# EAGLE design pcb_inverter (EAGLE 6.6.0)
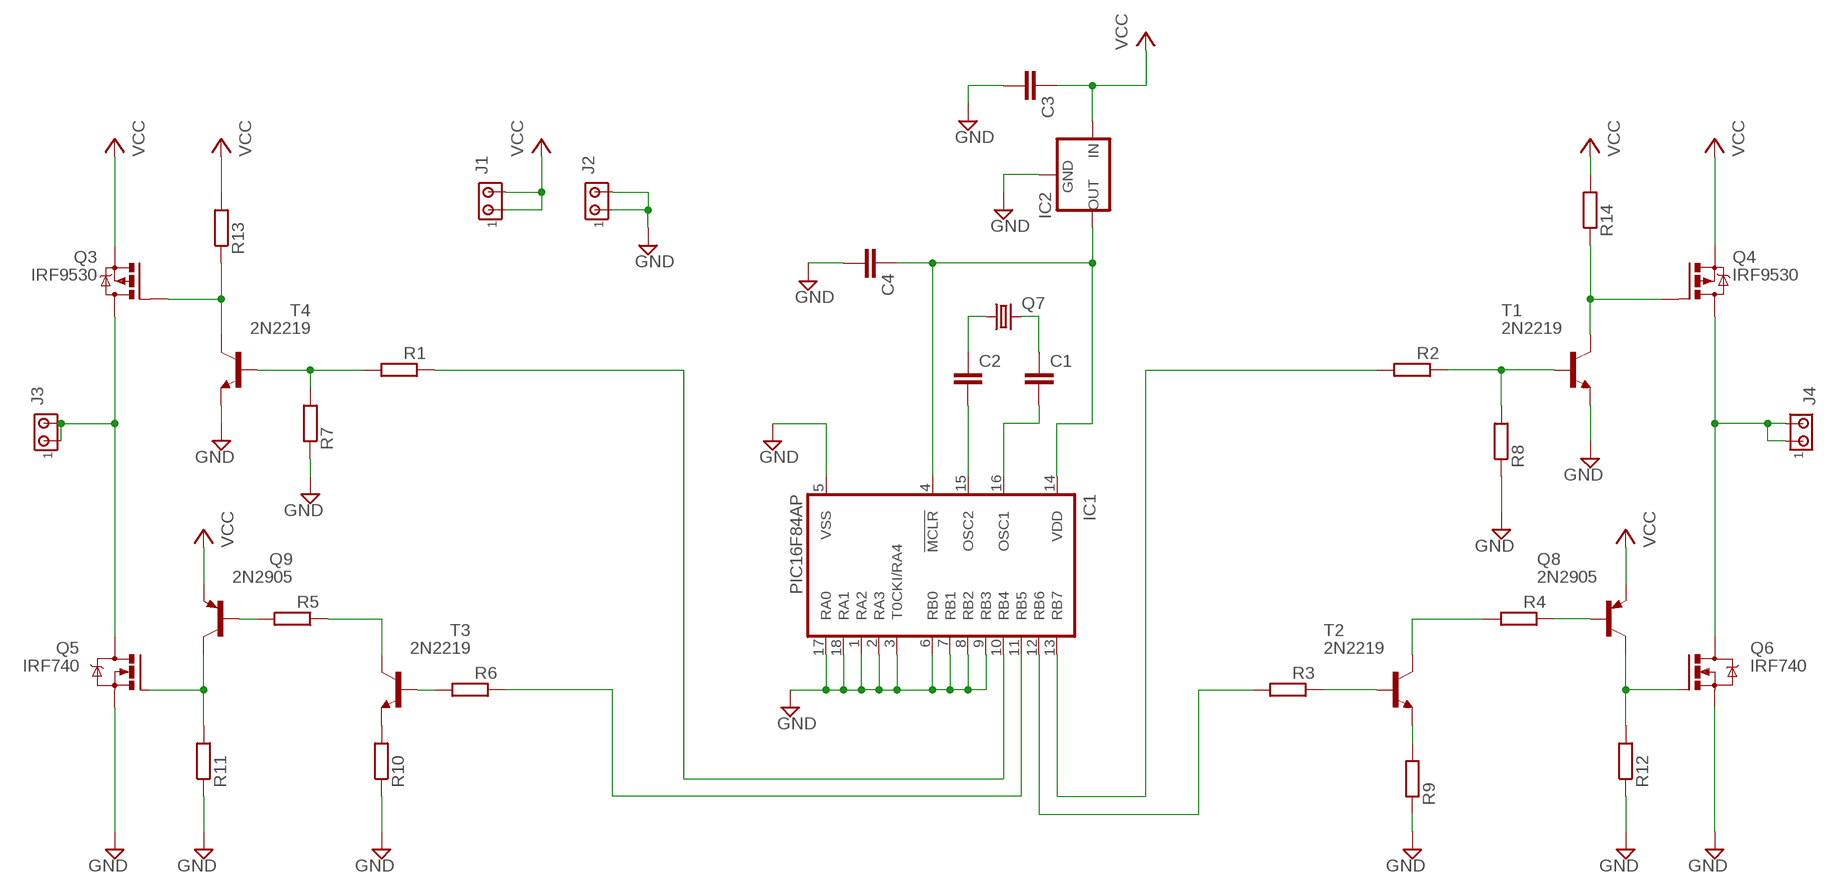
[diagram p0: schematic, sheet 1]

## Parts
C1  C2.5/5  [C2.5-5]
C2  C2.5/5  [C2.5-5]
C3  C2.5/5  [C2.5-5]
C4  C2.5/5  [C2.5-5]
IC1  PIC16F84AP  [DIL18]
IC2  78XXS  [78XXS]
J1  MTA02-156  [1X2MTA]
J2  MTA02-156  [1X2MTA]
J3  MTA02-156  [1X2MTA]
J4  MTA02-156  [1X2MTA]
Q3  IRF9530  [TO220BV]
Q4  IRF9530  [TO220BV]
Q5  IRF740  [TO220BV]
Q6  IRF740  [TO220BV]
Q7  CRYSTALHC18U-V  [HC18U-V]
Q8  2N2905  [TO5]
Q9  2N2905  [TO5]
R1  R-EU_0204/7  [0204/7]
R2  R-EU_0204/7  [0204/7]
R3  R-EU_0204/7  [0204/7]
R4  R-EU_0204/7  [0204/7]
R5  R-EU_0204/7  [0204/7]
R6  R-EU_0204/7  [0204/7]
R7  R-EU_0204/7  [0204/7]
R8  R-EU_0204/7  [0204/7]
R9  R-EU_0204/7  [0204/7]
R10  R-EU_0204/7  [0204/7]
R11  R-EU_0204/7  [0204/7]
R12  R-EU_0204/7  [0204/7]
R13  R-EU_0204/7  [0204/7]
R14  R-EU_0204/7  [0204/7]
T1  2N2219  [TO5]
T2  2N2219  [TO5]
T3  2N2219  [TO5]
T4  2N2219  [TO5]

## Nets
GND: C3.2 C4.2 IC1.1(RA2) IC1.2(RA3) IC1.3(T0CKI/RA4) IC1.5(VSS) IC1.6(RB0) IC1.7(RB1) IC1.8(RB2) IC1.9(RB3) IC1.17(RA0) IC1.18(RA1) IC2.GND J2.1 J2.2 Q5.S Q6.S R7.1 R8.1 R9.1 R10.1 R11.1 R12.1 T1.1(E) T4.1(E)
N$1: Q3.G R13.1 T4.3(C)
N$2: R1.2 R7.2 T4.2(B)
N$3: J3.1 J3.2 Q3.D Q5.D
N$4: Q6.G Q8.3(C) R12.2
N$5: Q5.G Q9.3(C) R11.2
N$6: Q9.2(B) R5.2
N$7: R5.1 T3.3(C)
N$8: R10.2 T3.1(E)
N$9: R6.2 T3.2(B)
N$10: IC1.11(RB5) R6.1
N$11: Q8.2(B) R4.1
N$12: R4.2 T2.3(C)
N$13: R9.2 T2.1(E)
N$14: R3.1 T2.2(B)
N$15: IC1.10(RB4) R1.1
N$16: J4.1 J4.2 Q4.D Q6.D
N$17: Q4.G R14.1 T1.3(C)
N$18: R2.1 R8.2 T1.2(B)
N$19: C2.1 Q7.1
N$20: C2.2 IC1.15(OSC2)
N$21: C1.2 IC1.16(OSC1)
N$22: C1.1 Q7.2
N$24: IC1.12(RB6) R3.2
N$25: IC1.13(RB7) R2.2
N$26: C4.1 IC1.4(!MCLR) IC1.14(VDD) IC2.OUT
VCC: C3.1 IC2.IN J1.1 J1.2 Q3.S Q4.S Q8.1(E) Q9.1(E) R13.2 R14.2

## Library data of the parts
C1-C4 = capacitor-wima:C: CAPACITOR naming: grid - package width
IC1 = microchip:PIC16F8*: MICROCONTROLLER 8-Bit PIC16F8X Family - CMOS Flash/EEPROM Pin Compatible : PIC16F83, PIC16CR83, PIC16F84A, PIC16CR84 see also PIC16C* <DEVICE:PIC16C*>; MF: MICROCHIP; MPN: PIC16F84A-04I/P; OC_FARNELL: 9760865; OC_NEWARK: 69K7635
IC2 = v-reg:78XXS: VOLTAGE REGULATOR
J1-J4 = con-amp:MTA02-156: AMP connector
Q3 Q4 = transistor-power:IRF9530: P-CHANNEL HEXFET POWER-MOS-FET Source: http://www.irf.com/product-info/datasheets/data/irf9530.pdf
Q5 Q6 = transistor-power:IRF740: N-CHANNEL MOS FET
Q7 = crystal:CRYSTAL: CRYSTAL; OC_FARNELL: unknown; OC_NEWARK: unknown
Q8 Q9 = transistor-pnp:2N2905: PNP Transistor
R1-R14 = rcl:R-EU_: RESISTOR, European symbol
T1-T4 = transistor:2N2219: NPN TRANSISTOR

## Board
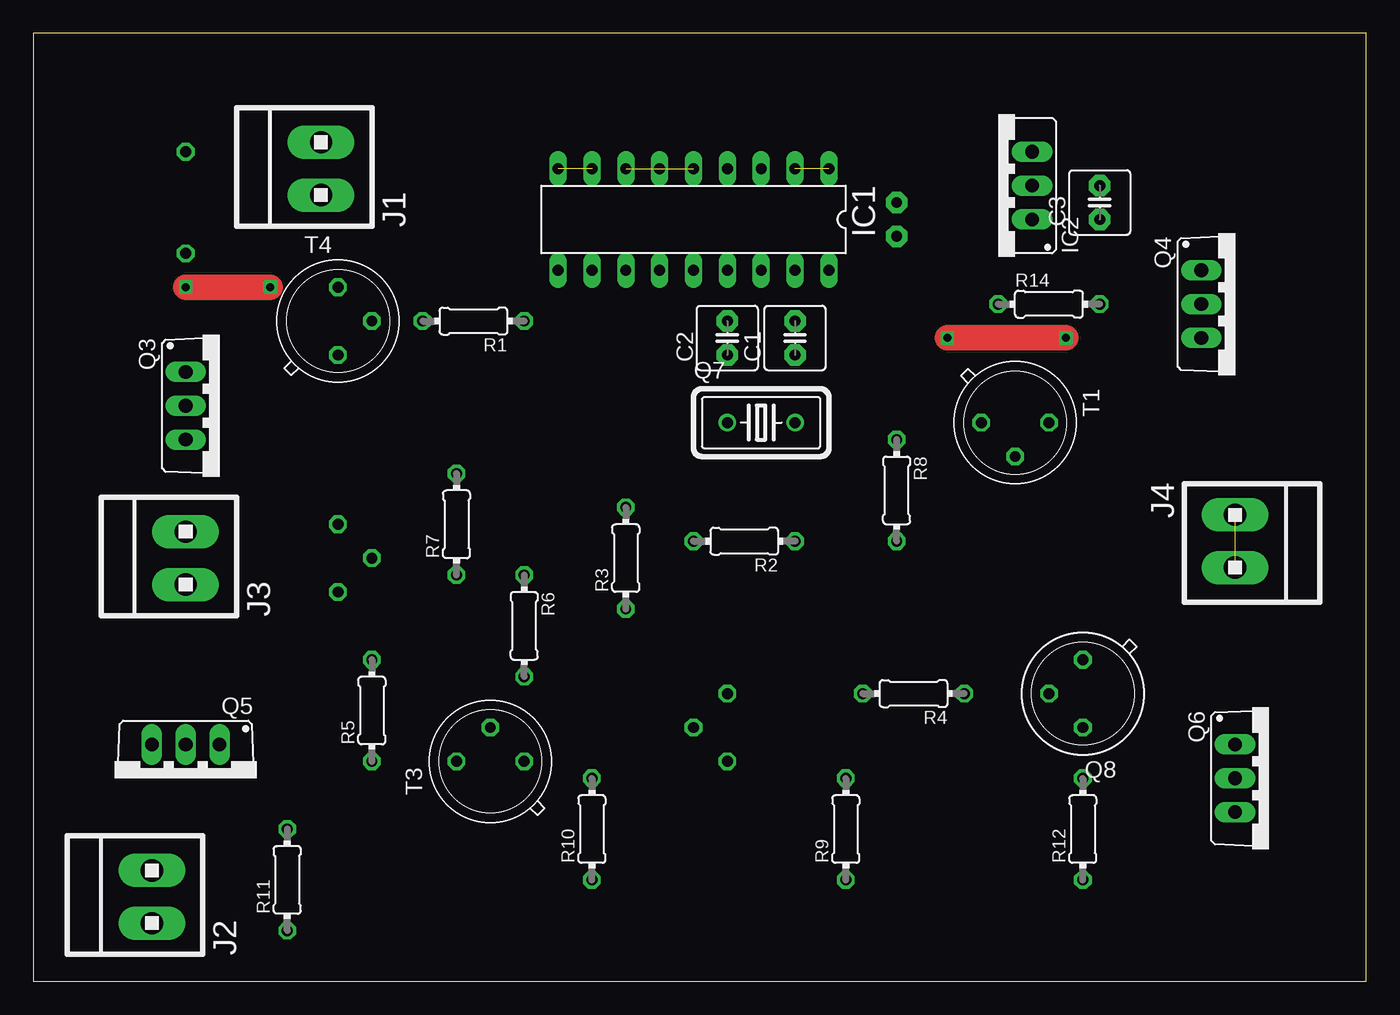
[diagram p1: board, top side]
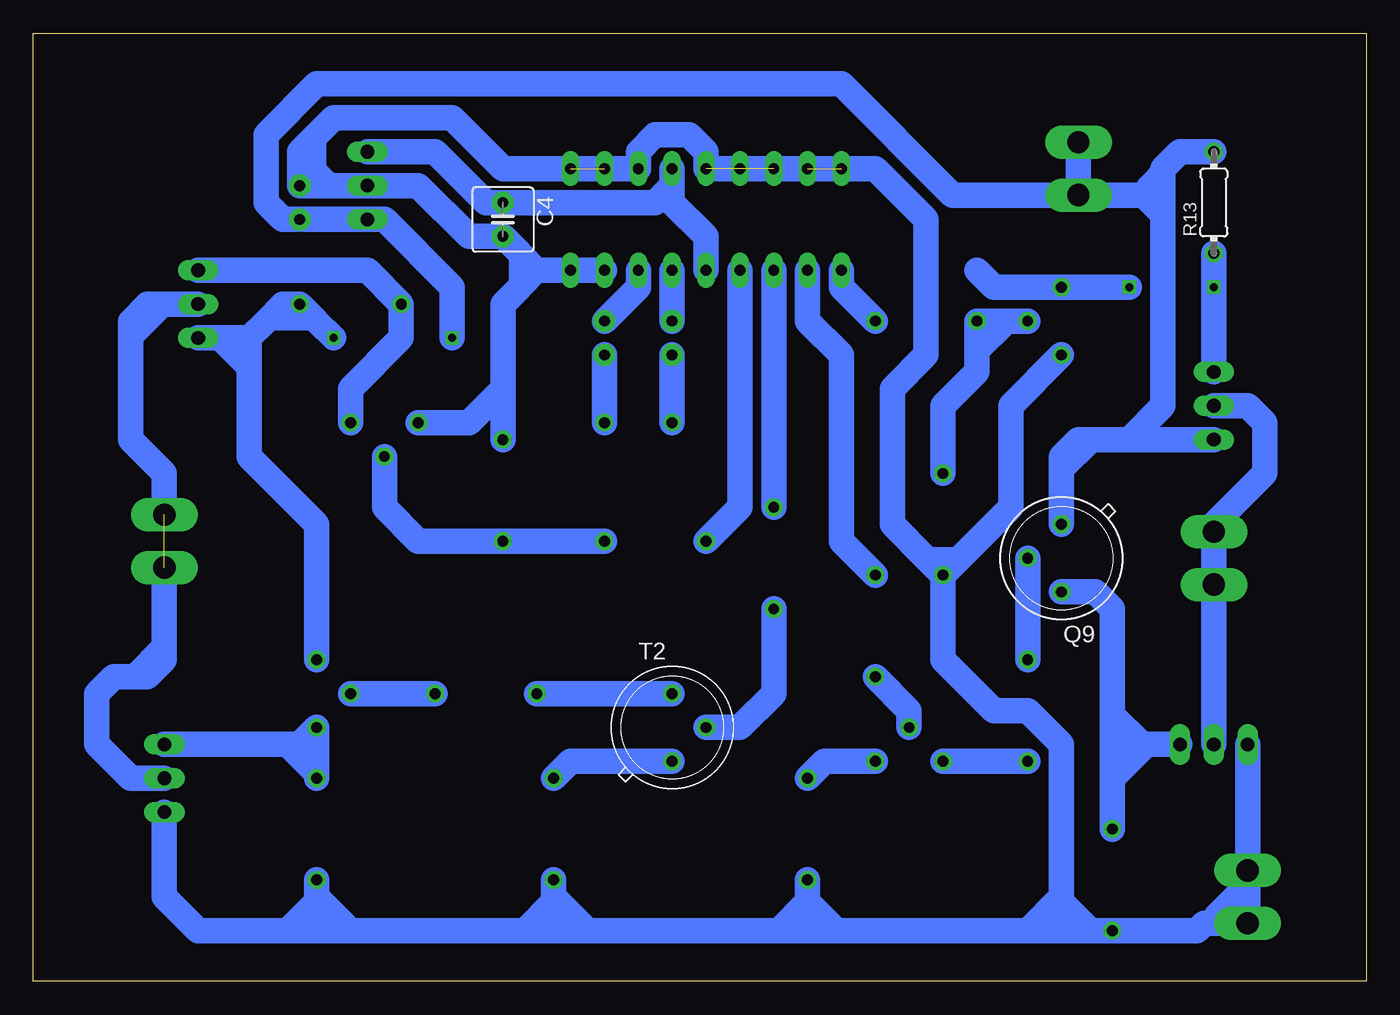
[diagram p2: board, bottom side, seen from below]

Size 100 x 71.11 mm. Coordinates in mm from the lower left corner, seen from the top.
Outline: 0,0 100,0 100,71.11 0,71.11 0,0
Copper layers (1*16): Top 0.035mm / dielectric 1.5mm / Bottom 0.035mm
Design rules "default": minimum track width 10mil, minimum drill 24mil, track to track 8mil, track to pad 8mil, pad to pad 8mil, via to via 8mil, smd to smd 8mil, copper to edge 40mil, drill to drill 8mil, minimum pad ring 10mil, minimum via ring 8mil, stop-mask expansion 4mil, vias tented up to drill 0mil, thermal gap 10mil

### Footprints (pad centres in the part's own frame; a part is rotated, then mirrored left to right if it is on the bottom)
C2.5-5 = drill 0.813 pad 1.6 octagon: 1 -1.27,0; 2 1.27,0
DIL18 = drill 0.813 long: 1 -10.16,-3.81; 2 -7.62,-3.81; 3 -5.08,-3.81; 4 -2.54,-3.81; 5 0,-3.81; 6 2.54,-3.81; 7 5.08,-3.81; 8 7.62,-3.81; 9 10.16,-3.81; 10 10.16,3.81; 11 7.62,3.81; 12 5.08,3.81; 13 2.54,3.81; 14 0,3.81; 15 -2.54,3.81; 16 -5.08,3.81; 17 -7.62,3.81; 18 -10.16,3.81
78XXS = drill 1.016 long: GND 0,-2.54; IN -2.54,-2.54; OUT 2.54,-2.54
1X2MTA = drill 1.676 long: 1 1.981,0; 2 -1.981,0
TO220BV = drill 1.016 long: D 0,-2.54; G -2.54,-2.54; S 2.54,-2.54
HC18U-V = drill 0.813: 1 -2.54,0; 2 2.54,0
TO5 = drill 0.813 octagon: 1 0,-2.54; 2 2.54,0; 3 0,2.54
0204/7 = drill 0.813 octagon: 1 -3.81,0; 2 3.81,0

### Placement (x,y rotation side)
C1  57.15,48.26 90 top
C2  52.07,48.26 90 top
C3  80.01,58.42 90 top
C4  64.77,57.15 270 bottom
IC1  49.53,57.15 180 top
IC2  72.39,59.69 90 top
J1  21.59,60.96 90 top
J2  8.89,6.35 90 top
J3  11.43,31.75 90 top
J4  90.17,33.02 270 top
Q3  13.97,43.18 270 top
Q4  90.17,50.8 270 top
Q5  11.43,15.24 180 top
Q6  92.71,15.24 270 top
Q7  54.61,41.91 0 top
Q8  78.74,21.59 180 top
Q9  22.86,31.75 180 bottom
R1  33.02,49.53 180 top
R2  53.34,33.02 180 top
R3  44.45,31.75 90 top
R4  66.04,21.59 180 top
R5  25.4,20.32 90 top
R6  36.83,26.67 270 top
R7  31.75,34.29 90 top
R8  64.77,36.83 270 top
R9  60.96,11.43 90 top
R10  41.91,11.43 90 top
R11  19.05,7.62 90 top
R12  78.74,11.43 90 top
R13  11.43,58.42 90 bottom
R14  76.2,50.8 0 top
T1  73.66,41.91 270 top
T2  52.07,19.05 0 bottom
T3  34.29,16.51 90 top
T4  22.86,49.53 0 top

### Tracks (layer width: path | path; a pad name or v marks a point on that pad's centre or on a via)
GND  (4 unrouted)
  Bottom 1.422: 80.01,62.23 78.74,60.96 | 78.74,60.96 77.47,59.69 | 78.74,63.5 78.74,60.96 | 11.43,5.08 8.89,7.62 8.89,6.35 10.16,5.08 | 22.86,6.35 20.32,3.81 21.59,3.81 22.86,5.08 | 44.45,3.81 41.91,6.35 39.37,3.81 | 60.96,6.35 63.5,3.81 62.23,3.81 60.96,5.08 | 78.74,6.35 81.28,3.81 80.01,3.81 78.74,5.08
  Bottom 1.676: 30.48,31.75 33.02,31.75 | 63.5,54.61 63.5,52.07
  Bottom 1.93: Q5.S J2.1 8.89,7.62 J2.2 12.14,4.37 12.7,3.81 R11.1 20.32,3.81 25.4,3.81 | 25.4,3.81 39.37,3.81 40.64,3.81 | 40.64,3.81 41.91,5.08 41.91,6.35 R10.1 | T4.1 26.67,43.18 26.67,35.56 30.48,31.75 R7.1 | 25.4,3.81 22.86,6.35 22.86,17.78 25.4,20.32 27.94,20.32 31.75,24.13 R7.1 | R9.1 60.96,6.35 58.42,3.81 | 58.42,3.81 44.45,3.81 40.64,3.81 | R12.1 78.74,6.35 76.2,3.81 | 76.2,3.81 63.5,3.81 58.42,3.81 | IC1.17 IC1.18 62.23,53.34 | 62.23,53.34 63.5,54.61 C4.2 67.31,55.88 71.12,59.69 IC2.GND 77.47,59.69 C3.2 80.01,62.23 78.74,63.5 77.47,64.77 68.58,64.77 64.77,60.96 IC1.1 IC1.3 54.61,62.23 53.34,63.5 50.8,63.5 49.53,62.23 IC1.5 IC1.9 36.83,60.96 33.02,57.15 33.02,46.99 35.56,44.45 35.56,34.29 33.02,31.75 R7.1 | Q6.S 90.17,6.35 87.63,3.81 81.28,3.81 76.2,3.81 | R8.1 64.77,44.45 | 64.77,44.45 64.77,50.8 63.5,52.07 62.23,53.34 | T1.1 67.31,41.91 64.77,44.45
N$1  (via drill 0.6)  (1 unrouted)
  Top 1.93: v11.43,52.07 17.78,52.07
  Bottom 1.93: Q3.G v11.43,52.07 R13.1 | 29.21,53.34 27.94,52.07 T4.3 17.78,52.07
N$2
  Bottom 1.422: 29.21,46.99 26.67,49.53
  Bottom 1.93: T4.2 26.67,49.53 R1.2 29.21,46.99 29.21,45.72 31.75,43.18 R7.2
N$3
  Bottom 1.93: Q5.D J3.2 J3.1 11.43,34.29 7.62,38.1 7.62,41.91 8.89,43.18 Q3.D
N$4
  Bottom 1.422: R12.2 81.28,17.78
  Bottom 1.93: R12.2 Q8.3 80.01,17.78 81.28,17.78 Q6.G
N$5
  Bottom 1.422: 16.51,17.78 19.05,20.32 19.05,19.05 17.78,17.78
  Bottom 1.93: R11.2 19.05,15.24 | 19.05,15.24 16.51,17.78 Q5.G | Q9.3 20.32,29.21 19.05,27.94 19.05,20.32 19.05,15.24
N$6
  Bottom 1.93: Q9.2 R5.2
N$7
  Bottom 1.93: R5.1 T3.3
N$8
  Bottom 1.93: T3.1 40.64,16.51 R10.2
N$9
  Bottom 1.93: T3.2 34.29,20.32 R6.2
N$10
  Bottom 1.93: R6.1 39.37,33.02 39.37,46.99 41.91,49.53 IC1.11
N$11
  Bottom 1.93: R4.1 Q8.2
N$12
  Bottom 1.93: T2.3 R4.2
N$13
  Bottom 1.93: R9.2 59.69,16.51 T2.1
N$14
  Bottom 1.93: T2.2 46.99,19.05 44.45,21.59 R3.1
N$15
  Bottom 1.93: R1.1 39.37,52.07 IC1.10
N$16  (1 unrouted)
  Bottom 1.422: 92.71,22.86 90.17,25.4
  Bottom 1.676: 92.71,48.26 90.17,50.8
  Bottom 1.93: Q6.D 92.71,15.24 95.25,17.78 95.25,21.59 93.98,22.86 92.71,22.86 91.44,22.86 90.17,24.13 90.17,25.4 J4.1 | J4.2 90.17,38.1 92.71,40.64 92.71,48.26 92.71,49.53 91.44,50.8 90.17,50.8 Q4.D
N$17
  Bottom 1.93: T1.3 76.2,44.45 72.39,48.26 R14.1 74.93,53.34 Q4.G
N$18
  Bottom 1.93: R2.1 R8.2 71.12,33.02 73.66,35.56 T1.2
N$19
  Bottom 1.93: C2.1 Q7.1
N$20
  Bottom 1.93: IC1.15 C2.2
N$21
  Bottom 1.93: C1.2 54.61,52.07 IC1.16
N$22
  Bottom 1.93: Q7.2 C1.1
N$23  (via drill 0.6)
  other vias: 17.78,52.07
N$24
  Bottom 1.93: IC1.12 R3.2
N$25
  Bottom 1.93: IC1.13 46.99,35.56 R2.2
N$26
  Bottom 1.93: IC1.14 49.53,55.88 52.07,58.42 52.07,59.69 | 52.07,59.69 IC1.4 | 52.07,59.69 53.34,58.42 C4.1 66.04,58.42 69.85,62.23 IC2.OUT
VCC  (via drill 0.6)
  Top 1.93: v77.47,48.26 v68.58,48.26
  Bottom 1.422: 16.51,59.69 15.24,60.96 | 15.24,57.15 16.51,58.42 | 22.86,38.1 20.32,40.64 | 78.74,49.53 82.55,49.53 | 83.82,45.72 86.36,48.26
  Bottom 1.93: Q3.S 17.78,40.64 | 17.78,40.64 20.32,40.64 21.59,40.64 22.86,39.37 22.86,38.1 Q9.1 | Q8.1 78.74,34.29 83.82,39.37 83.82,45.72 83.82,48.26 | 83.82,48.26 82.55,49.53 81.28,50.8 R14.2 78.74,49.53 v77.47,48.26 | Q4.S 86.36,48.26 83.82,48.26 | 17.78,40.64 15.24,43.18 15.24,57.15 15.24,58.42 | J1.2 15.8,58.98 15.24,58.42 | J1.2 J1.1 | J1.2 31.04,58.98 39.37,67.31 78.74,67.31 82.55,63.5 82.55,58.42 81.28,57.15 C3.1 IC2.IN 73.66,57.15 68.58,52.07 v68.58,48.26 | 15.24,58.42 15.24,60.96 13.97,62.23 R13.2